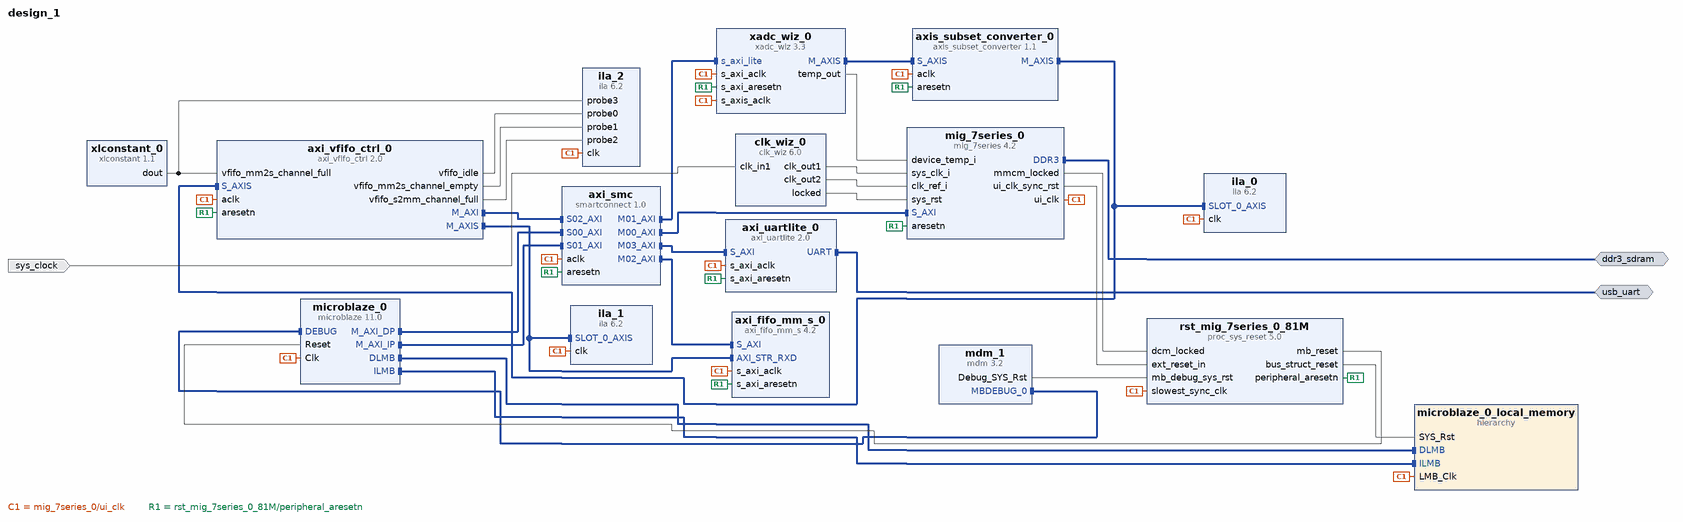
[diagram p0: block diagram of the top level]
# Vivado block design design_1, xc7s50csga324-1, Vivado 2021.1_AR76668
create_bd_design design_1

create_bd_intf_port -mode Master -vlnv xilinx.com:interface:ddrx_rtl:1.0 ddr3_sdram
create_bd_intf_port -mode Master -vlnv xilinx.com:interface:uart_rtl:1.0 usb_uart
create_bd_port -dir I -type clk sys_clock
set_property -dict {CONFIG.FREQ_HZ 12000000 CONFIG.PHASE 0.0} [get_bd_ports sys_clock]

create_bd_cell -type ip -vlnv xilinx.com:ip:mig_7series:4.2 mig_7series_0
set_property -dict [list \
  CONFIG.BOARD_MIG_PARAM ddr3_sdram \
  CONFIG.MIG_DONT_TOUCH_PARAM Custom \
  CONFIG.RESET_BOARD_INTERFACE Custom \
  CONFIG.XML_INPUT_FILE mig_a.prj \
] [get_bd_cells mig_7series_0]
create_bd_cell -type ip -vlnv xilinx.com:ip:axi_vfifo_ctrl:2.0 axi_vfifo_ctrl_0
set_property -dict [list \
  CONFIG.axis_tuser_width 4 \
  CONFIG.dram_base_addr 8fff0000 \
  CONFIG.enable_axis_tuser true \
] [get_bd_cells axi_vfifo_ctrl_0]
create_bd_cell -type ip -vlnv xilinx.com:ip:microblaze:11.0 microblaze_0
set_property -dict [list \
  CONFIG.C_ADDR_TAG_BITS 0 \
  CONFIG.C_DCACHE_ADDR_TAG 0 \
  CONFIG.C_DEBUG_ENABLED 1 \
  CONFIG.C_D_AXI 1 \
  CONFIG.C_D_LMB 1 \
  CONFIG.C_I_AXI 1 \
  CONFIG.C_I_LMB 1 \
  CONFIG.C_USE_DCACHE 0 \
  CONFIG.C_USE_ICACHE 0 \
] [get_bd_cells microblaze_0]
create_bd_cell -type hier microblaze_0_local_memory
create_bd_cell -type ip -vlnv xilinx.com:ip:mdm:3.2 mdm_1
create_bd_cell -type ip -vlnv xilinx.com:ip:proc_sys_reset:5.0 rst_mig_7series_0_81M
create_bd_cell -type ip -vlnv xilinx.com:ip:smartconnect:1.0 axi_smc
set_property -dict {CONFIG.NUM_MI 4 CONFIG.NUM_SI 3} [get_bd_cells axi_smc]
create_bd_cell -type ip -vlnv xilinx.com:ip:clk_wiz:6.0 clk_wiz_0
set_property -dict [list \
  CONFIG.CLKOUT1_JITTER 571.161 \
  CONFIG.CLKOUT1_PHASE_ERROR 613.025 \
  CONFIG.CLKOUT2_JITTER 522.440 \
  CONFIG.CLKOUT2_PHASE_ERROR 613.025 \
  CONFIG.CLKOUT2_REQUESTED_OUT_FREQ 200.000 \
  CONFIG.CLKOUT2_USED true \
  CONFIG.CLK_IN1_BOARD_INTERFACE sys_clock \
  CONFIG.MMCM_CLKFBOUT_MULT_F 50.000 \
  CONFIG.MMCM_CLKOUT0_DIVIDE_F 6.000 \
  CONFIG.MMCM_CLKOUT1_DIVIDE 3 \
  CONFIG.NUM_OUT_CLKS 2 \
  CONFIG.USE_BOARD_FLOW true \
  CONFIG.USE_RESET false \
] [get_bd_cells clk_wiz_0]
create_bd_cell -type ip -vlnv xilinx.com:ip:xadc_wiz:3.3 xadc_wiz_0
set_property -dict [list \
  CONFIG.ENABLE_AXI4STREAM true \
  CONFIG.ENABLE_TEMP_BUS true \
  CONFIG.OT_ALARM false \
  CONFIG.USER_TEMP_ALARM false \
  CONFIG.VCCAUX_ALARM false \
  CONFIG.VCCINT_ALARM false \
] [get_bd_cells xadc_wiz_0]
create_bd_cell -type ip -vlnv xilinx.com:ip:axis_subset_converter:1.1 axis_subset_converter_0
set_property -dict [list \
  CONFIG.DEFAULT_TLAST 256 \
  CONFIG.M_HAS_TLAST 1 \
  CONFIG.M_TDATA_NUM_BYTES 4 \
  CONFIG.TDATA_REMAP {16'b0000000000000000,tdata[15:0]} \
] [get_bd_cells axis_subset_converter_0]
create_bd_cell -type ip -vlnv xilinx.com:ip:axi_fifo_mm_s:4.2 axi_fifo_mm_s_0
set_property -dict [list \
  CONFIG.C_DATA_INTERFACE_TYPE 0 \
  CONFIG.C_USE_RX_CUT_THROUGH false \
  CONFIG.C_USE_TX_CTRL 0 \
  CONFIG.C_USE_TX_DATA 0 \
] [get_bd_cells axi_fifo_mm_s_0]
create_bd_cell -type ip -vlnv xilinx.com:ip:axi_uartlite:2.0 axi_uartlite_0
set_property -dict [list \
  CONFIG.C_BAUDRATE 115200 \
  CONFIG.UARTLITE_BOARD_INTERFACE usb_uart \
  CONFIG.USE_BOARD_FLOW true \
] [get_bd_cells axi_uartlite_0]
create_bd_cell -type ip -vlnv xilinx.com:ip:ila:6.2 ila_0
set_property -dict {CONFIG.C_NUM_OF_PROBES 9 CONFIG.C_SLOT_0_AXI_PROTOCOL AXI4S} [get_bd_cells ila_0]
create_bd_cell -type ip -vlnv xilinx.com:ip:ila:6.2 ila_1
set_property -dict {CONFIG.C_NUM_OF_PROBES 9 CONFIG.C_SLOT_0_AXI_PROTOCOL AXI4S} [get_bd_cells ila_1]
create_bd_cell -type ip -vlnv xilinx.com:ip:ila:6.2 ila_2
set_property -dict [list \
  CONFIG.C_ENABLE_ILA_AXI_MON false \
  CONFIG.C_MONITOR_TYPE Native \
  CONFIG.C_NUM_OF_PROBES 4 \
  CONFIG.C_PROBE0_WIDTH 2 \
  CONFIG.C_PROBE1_WIDTH 2 \
  CONFIG.C_PROBE2_WIDTH 2 \
  CONFIG.C_PROBE3_WIDTH 2 \
] [get_bd_cells ila_2]
create_bd_cell -type ip -vlnv xilinx.com:ip:xlconstant:1.1 xlconstant_0
set_property -dict {CONFIG.CONST_VAL 0x0 CONFIG.CONST_WIDTH 2} [get_bd_cells xlconstant_0]

# ---- hierarchy /microblaze_0_local_memory ----
current_bd_instance /microblaze_0_local_memory
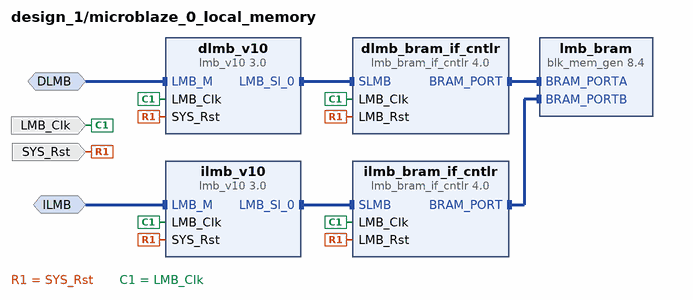
[diagram p1: block diagram inside /microblaze_0_local_memory]
create_bd_intf_pin -mode MirroredMaster -vlnv xilinx.com:interface:lmb_rtl:1.0 DLMB
create_bd_intf_pin -mode MirroredMaster -vlnv xilinx.com:interface:lmb_rtl:1.0 ILMB
create_bd_pin -dir I -type clk LMB_Clk
create_bd_pin -dir I -type rst SYS_Rst

create_bd_cell -type ip -vlnv xilinx.com:ip:lmb_v10:3.0 dlmb_v10
create_bd_cell -type ip -vlnv xilinx.com:ip:lmb_v10:3.0 ilmb_v10
create_bd_cell -type ip -vlnv xilinx.com:ip:lmb_bram_if_cntlr:4.0 dlmb_bram_if_cntlr
set_property -dict {CONFIG.C_ECC 0} [get_bd_cells dlmb_bram_if_cntlr]
create_bd_cell -type ip -vlnv xilinx.com:ip:lmb_bram_if_cntlr:4.0 ilmb_bram_if_cntlr
set_property -dict {CONFIG.C_ECC 0} [get_bd_cells ilmb_bram_if_cntlr]
create_bd_cell -type ip -vlnv xilinx.com:ip:blk_mem_gen:8.4 lmb_bram
set_property -dict {CONFIG.Memory_Type True_Dual_Port_RAM CONFIG.use_bram_block BRAM_Controller} [get_bd_cells lmb_bram]

# ---- connections ----

current_bd_instance /microblaze_0_local_memory
connect_bd_intf_net -intf_net microblaze_0_dlmb [get_bd_intf_pins DLMB] [get_bd_intf_pins dlmb_v10/LMB_M]
connect_bd_intf_net -intf_net microblaze_0_dlmb_bus [get_bd_intf_pins dlmb_v10/LMB_Sl_0] [get_bd_intf_pins dlmb_bram_if_cntlr/SLMB]
connect_bd_intf_net -intf_net microblaze_0_dlmb_cntlr [get_bd_intf_pins dlmb_bram_if_cntlr/BRAM_PORT] [get_bd_intf_pins lmb_bram/BRAM_PORTA]
connect_bd_intf_net -intf_net microblaze_0_ilmb [get_bd_intf_pins ILMB] [get_bd_intf_pins ilmb_v10/LMB_M]
connect_bd_intf_net -intf_net microblaze_0_ilmb_bus [get_bd_intf_pins ilmb_v10/LMB_Sl_0] [get_bd_intf_pins ilmb_bram_if_cntlr/SLMB]
connect_bd_intf_net -intf_net microblaze_0_ilmb_cntlr [get_bd_intf_pins ilmb_bram_if_cntlr/BRAM_PORT] [get_bd_intf_pins lmb_bram/BRAM_PORTB]
connect_bd_net [get_bd_pins SYS_Rst] \
  [get_bd_pins dlmb_v10/SYS_Rst] [get_bd_pins dlmb_bram_if_cntlr/LMB_Rst] [get_bd_pins ilmb_v10/SYS_Rst] \
  [get_bd_pins ilmb_bram_if_cntlr/LMB_Rst]
connect_bd_net -net microblaze_0_Clk [get_bd_pins LMB_Clk] \
  [get_bd_pins dlmb_v10/LMB_Clk] [get_bd_pins dlmb_bram_if_cntlr/LMB_Clk] [get_bd_pins ilmb_v10/LMB_Clk] \
  [get_bd_pins ilmb_bram_if_cntlr/LMB_Clk]
set_property HDL_ATTRIBUTE.BMM_INFO_ADDRESS_SPACE {byte  0x00000000 32 > design_1 microblaze_0_local_memory/lmb_bram} [get_bd_cells dlmb_bram_if_cntlr]
set_property HDL_ATTRIBUTE.KEEP_HIERARCHY yes [get_bd_cells dlmb_bram_if_cntlr]

current_bd_instance /
connect_bd_intf_net [get_bd_intf_pins axi_smc/M00_AXI] [get_bd_intf_pins mig_7series_0/S_AXI]
connect_bd_intf_net [get_bd_intf_pins axi_smc/M01_AXI] [get_bd_intf_pins xadc_wiz_0/s_axi_lite]
connect_bd_intf_net [get_bd_intf_pins axi_smc/M02_AXI] [get_bd_intf_pins axi_fifo_mm_s_0/S_AXI]
connect_bd_intf_net [get_bd_intf_pins axi_smc/M03_AXI] [get_bd_intf_pins axi_uartlite_0/S_AXI]
connect_bd_intf_net [get_bd_intf_ports usb_uart] [get_bd_intf_pins axi_uartlite_0/UART]
connect_bd_intf_net [get_bd_intf_pins axi_vfifo_ctrl_0/M_AXI] [get_bd_intf_pins axi_smc/S02_AXI]
connect_bd_intf_net [get_bd_intf_pins axi_fifo_mm_s_0/AXI_STR_RXD] [get_bd_intf_pins axi_vfifo_ctrl_0/M_AXIS]
connect_bd_intf_net [get_bd_intf_pins axi_fifo_mm_s_0/AXI_STR_RXD] [get_bd_intf_pins ila_1/SLOT_0_AXIS]
connect_bd_intf_net [get_bd_intf_pins axis_subset_converter_0/M_AXIS] [get_bd_intf_pins axi_vfifo_ctrl_0/S_AXIS]
connect_bd_intf_net [get_bd_intf_pins axis_subset_converter_0/M_AXIS] [get_bd_intf_pins ila_0/SLOT_0_AXIS]
connect_bd_intf_net [get_bd_intf_pins microblaze_0/M_AXI_DP] [get_bd_intf_pins axi_smc/S00_AXI]
connect_bd_intf_net [get_bd_intf_pins microblaze_0/M_AXI_IP] [get_bd_intf_pins axi_smc/S01_AXI]
connect_bd_intf_net [get_bd_intf_pins mdm_1/MBDEBUG_0] [get_bd_intf_pins microblaze_0/DEBUG]
connect_bd_intf_net [get_bd_intf_pins microblaze_0/DLMB] [get_bd_intf_pins microblaze_0_local_memory/DLMB]
connect_bd_intf_net [get_bd_intf_pins microblaze_0/ILMB] [get_bd_intf_pins microblaze_0_local_memory/ILMB]
connect_bd_intf_net [get_bd_intf_ports ddr3_sdram] [get_bd_intf_pins mig_7series_0/DDR3]
connect_bd_intf_net [get_bd_intf_pins xadc_wiz_0/M_AXIS] [get_bd_intf_pins axis_subset_converter_0/S_AXIS]
connect_bd_net [get_bd_pins xlconstant_0/dout] [get_bd_pins axi_vfifo_ctrl_0/vfifo_mm2s_channel_full] [get_bd_pins ila_2/probe3]
connect_bd_net [get_bd_pins axi_vfifo_ctrl_0/vfifo_idle] [get_bd_pins ila_2/probe0]
connect_bd_net [get_bd_pins axi_vfifo_ctrl_0/vfifo_mm2s_channel_empty] [get_bd_pins ila_2/probe1]
connect_bd_net [get_bd_pins axi_vfifo_ctrl_0/vfifo_s2mm_channel_full] [get_bd_pins ila_2/probe2]
connect_bd_net [get_bd_pins clk_wiz_0/clk_out1] [get_bd_pins mig_7series_0/sys_clk_i]
connect_bd_net [get_bd_pins clk_wiz_0/clk_out2] [get_bd_pins mig_7series_0/clk_ref_i]
connect_bd_net [get_bd_pins clk_wiz_0/locked] [get_bd_pins mig_7series_0/sys_rst]
connect_bd_net [get_bd_pins mdm_1/Debug_SYS_Rst] [get_bd_pins rst_mig_7series_0_81M/mb_debug_sys_rst]
connect_bd_net -net microblaze_0_Clk [get_bd_pins mig_7series_0/ui_clk] \
  [get_bd_pins microblaze_0/Clk] [get_bd_pins microblaze_0_local_memory/LMB_Clk] \
  [get_bd_pins rst_mig_7series_0_81M/slowest_sync_clk] [get_bd_pins axi_smc/aclk] [get_bd_pins xadc_wiz_0/s_axi_aclk] \
  [get_bd_pins xadc_wiz_0/s_axis_aclk] [get_bd_pins axi_vfifo_ctrl_0/aclk] [get_bd_pins axis_subset_converter_0/aclk] \
  [get_bd_pins axi_fifo_mm_s_0/s_axi_aclk] [get_bd_pins axi_uartlite_0/s_axi_aclk] [get_bd_pins ila_0/clk] \
  [get_bd_pins ila_1/clk] [get_bd_pins ila_2/clk]
connect_bd_net [get_bd_pins mig_7series_0/mmcm_locked] [get_bd_pins rst_mig_7series_0_81M/dcm_locked]
connect_bd_net [get_bd_pins mig_7series_0/ui_clk_sync_rst] [get_bd_pins rst_mig_7series_0_81M/ext_reset_in]
connect_bd_net [get_bd_pins rst_mig_7series_0_81M/bus_struct_reset] [get_bd_pins microblaze_0_local_memory/SYS_Rst]
connect_bd_net [get_bd_pins rst_mig_7series_0_81M/mb_reset] [get_bd_pins microblaze_0/Reset]
connect_bd_net [get_bd_pins rst_mig_7series_0_81M/peripheral_aresetn] \
  [get_bd_pins mig_7series_0/aresetn] [get_bd_pins axi_smc/aresetn] [get_bd_pins xadc_wiz_0/s_axi_aresetn] \
  [get_bd_pins axi_vfifo_ctrl_0/aresetn] [get_bd_pins axis_subset_converter_0/aresetn] \
  [get_bd_pins axi_fifo_mm_s_0/s_axi_aresetn] [get_bd_pins axi_uartlite_0/s_axi_aresetn]
connect_bd_net [get_bd_ports sys_clock] [get_bd_pins clk_wiz_0/clk_in1]
connect_bd_net [get_bd_pins xadc_wiz_0/temp_out] [get_bd_pins mig_7series_0/device_temp_i]
set_property HDL_ATTRIBUTE.BMM_INFO_PROCESSOR {microblaze-le > design_1 microblaze_0_local_memory/dlmb_bram_if_cntlr} [get_bd_cells microblaze_0]
set_property HDL_ATTRIBUTE.KEEP_HIERARCHY yes [get_bd_cells microblaze_0]

# ---- address map ----
assign_bd_address -offset 0x80000000 -range 256M -target_address_space [get_bd_addr_spaces axi_vfifo_ctrl_0/Data_S2MM] [get_bd_addr_segs mig_7series_0/memmap/memaddr]
exclude_bd_addr_seg -offset 0x40600000 -range 64K -target_address_space [get_bd_addr_spaces axi_vfifo_ctrl_0/Data_S2MM] [get_bd_addr_segs axi_uartlite_0/S_AXI/Reg]
exclude_bd_addr_seg -offset 0x44A00000 -range 64K -target_address_space [get_bd_addr_spaces axi_vfifo_ctrl_0/Data_S2MM] [get_bd_addr_segs xadc_wiz_0/s_axi_lite/Reg]
exclude_bd_addr_seg -offset 0x44A10000 -range 64K -target_address_space [get_bd_addr_spaces axi_vfifo_ctrl_0/Data_S2MM] [get_bd_addr_segs axi_fifo_mm_s_0/S_AXI/Mem0]
assign_bd_address -offset 0x00000000 -range 32K -target_address_space [get_bd_addr_spaces microblaze_0/Data] [get_bd_addr_segs microblaze_0_local_memory/dlmb_bram_if_cntlr/SLMB/Mem]
assign_bd_address -offset 0x40600000 -range 64K -target_address_space [get_bd_addr_spaces microblaze_0/Data] [get_bd_addr_segs axi_uartlite_0/S_AXI/Reg]
assign_bd_address -offset 0x44A00000 -range 64K -target_address_space [get_bd_addr_spaces microblaze_0/Data] [get_bd_addr_segs xadc_wiz_0/s_axi_lite/Reg]
assign_bd_address -offset 0x44A10000 -range 64K -target_address_space [get_bd_addr_spaces microblaze_0/Data] [get_bd_addr_segs axi_fifo_mm_s_0/S_AXI/Mem0]
assign_bd_address -offset 0x80000000 -range 256M -target_address_space [get_bd_addr_spaces microblaze_0/Data] [get_bd_addr_segs mig_7series_0/memmap/memaddr]
assign_bd_address -offset 0x00000000 -range 32K -target_address_space [get_bd_addr_spaces microblaze_0/Instruction] [get_bd_addr_segs microblaze_0_local_memory/ilmb_bram_if_cntlr/SLMB/Mem]
assign_bd_address -offset 0x40600000 -range 64K -target_address_space [get_bd_addr_spaces microblaze_0/Instruction] [get_bd_addr_segs axi_uartlite_0/S_AXI/Reg]
assign_bd_address -offset 0x44A00000 -range 64K -target_address_space [get_bd_addr_spaces microblaze_0/Instruction] [get_bd_addr_segs xadc_wiz_0/s_axi_lite/Reg]
assign_bd_address -offset 0x44A10000 -range 64K -target_address_space [get_bd_addr_spaces microblaze_0/Instruction] [get_bd_addr_segs axi_fifo_mm_s_0/S_AXI/Mem0]
assign_bd_address -offset 0x80000000 -range 256M -target_address_space [get_bd_addr_spaces microblaze_0/Instruction] [get_bd_addr_segs mig_7series_0/memmap/memaddr]

validate_bd_design
save_bd_design
